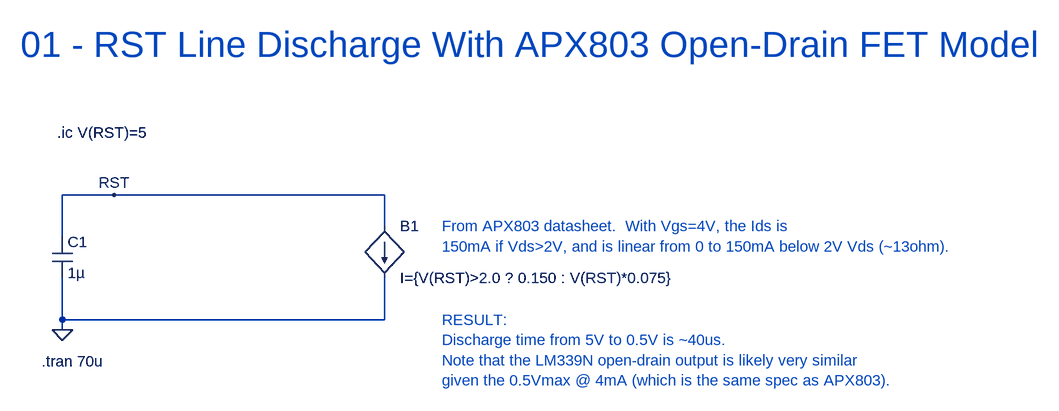
[diagram p0: schematic 01 - RST Line Discharge.asc]
01 - RST Line Discharge.asc, the LTspice schematic file:
Version 4.1
SHEET 1 1336 680
WIRE -160 -624 -240 -624
WIRE 256 -624 -160 -624
WIRE 256 -576 256 -624
WIRE -240 -560 -240 -624
WIRE -240 -432 -240 -496
WIRE 256 -432 256 -496
WIRE 256 -432 -240 -432
WIRE -240 -416 -240 -432
FLAG -240 -416 0
FLAG -160 -624 RST
SYMBOL cap -256 -560 R0
SYMATTR InstName C1
SYMATTR Value 1µ
SYMBOL bi 256 -576 R0
SYMATTR InstName B1
SYMATTR Value I={V(RST)>2.0 ? 0.150 : V(RST)*0.075}
TEXT -248 -720 Left 2 !.ic V(RST)=5
TEXT -272 -368 Left 2 !.tran 70u
TEXT -304 -856 Left 5 ;01 - RST Line Discharge With APX803 Open-Drain FET Model
TEXT 344 -576 Left 2 ;From APX803 datasheet.  With Vgs=4V, the Ids is\n150mA if Vds>2V, and is linear from 0 to 150mA below 2V Vds (~13ohm).
TEXT 344 -432 Left 2 ;RESULT:\nDischarge time from 5V to 0.5V is ~40us.\nNote that the LM339N open-drain output is likely very similar\ngiven the 0.5Vmax @ 4mA (which is the same spec as APX803).

The netlist it stands for:
* 01 - RST Line Discharge.asc
C1 RST 0 1µ
B1 RST 0 I={V(RST)>2.0 ? 0.150 : V(RST)*0.075}
.ic V(RST)=5
.tran 70u
* 01 - RST Line Discharge With APX803 Open-Drain FET Model
* From APX803 datasheet.  With Vgs=4V, the Ids is
* 150mA if Vds>2V, and is linear from 0 to 150mA below 2V Vds (~13ohm).
* RESULT:
* Discharge time from 5V to 0.5V is ~40us.
* Note that the LM339N open-drain output is likely very similar
* given the 0.5Vmax @ 4mA (which is the same spec as APX803).
.backanno
.end